# EAGLE design SolenoidDriverCircuit (EAGLE 6.4)
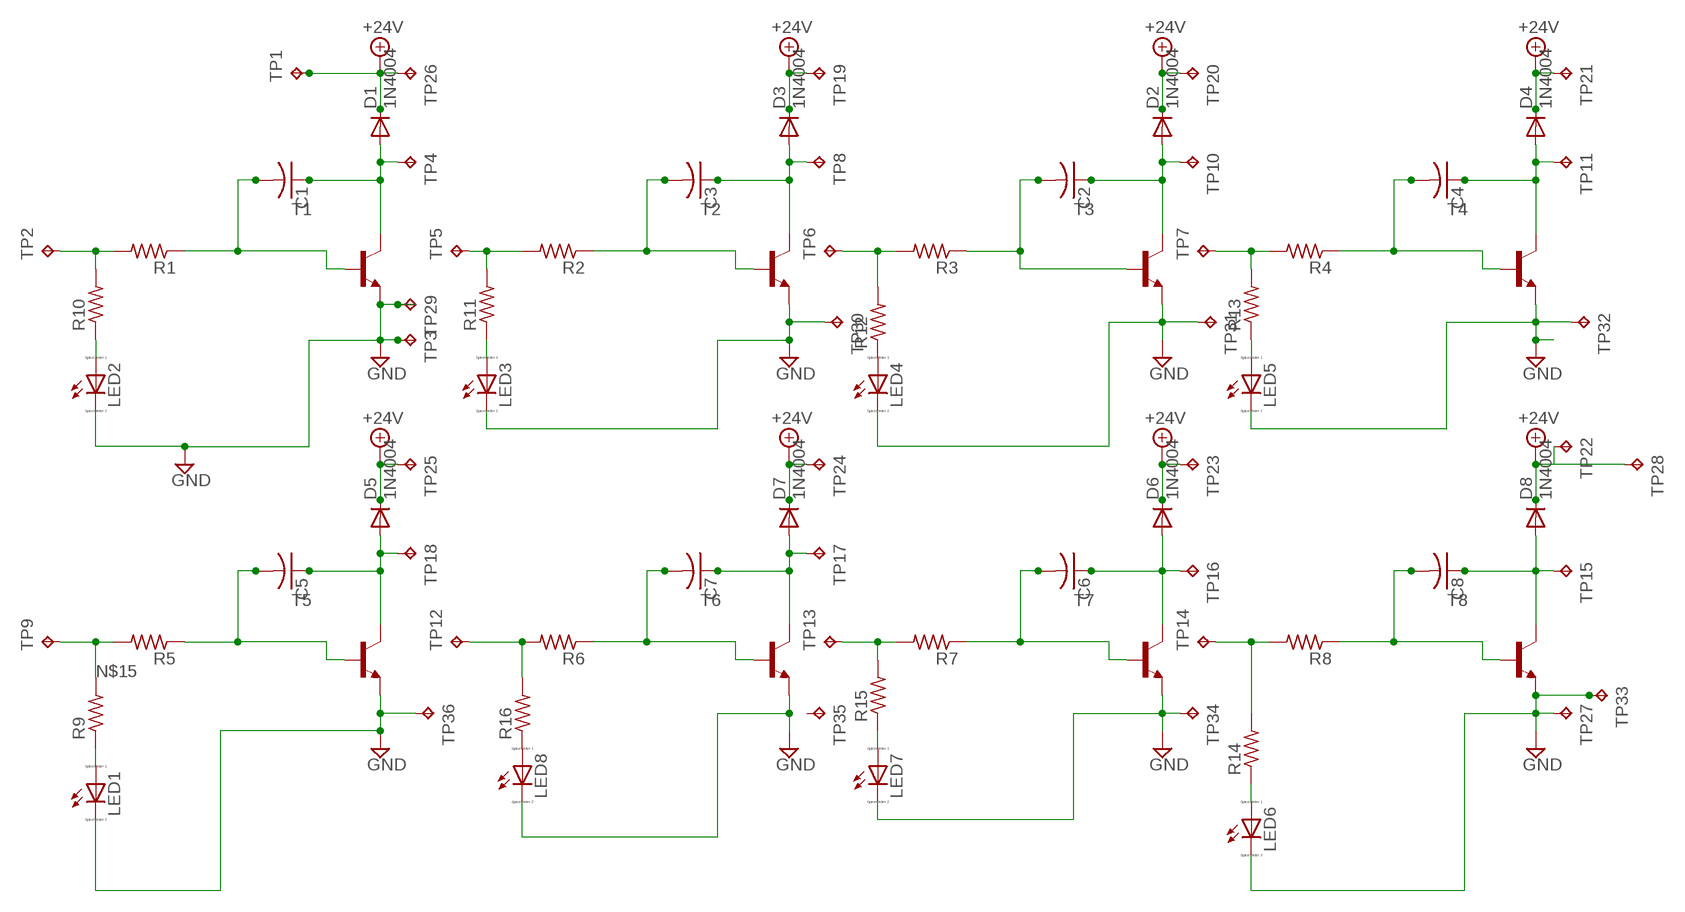
[diagram p0: schematic, sheet 1]

## Parts
C1  C-US050-024X044  [C050-024X044]
C2  C-US050-024X044  [C050-024X044]
C3  C-US050-024X044  [C050-024X044]
C4  C-US050-024X044  [C050-024X044]
C5  C-US050-024X044  [C050-024X044]
C6  C-US050-024X044  [C050-024X044]
C7  C-US050-024X044  [C050-024X044]
C8  C-US050-024X044  [C050-024X044]
D1  1N4004  [DO41-10]
D2  1N4004  [DO41-10]
D3  1N4004  [DO41-10]
D4  1N4004  [DO41-10]
D5  1N4004  [DO41-10]
D6  1N4004  [DO41-10]
D7  1N4004  [DO41-10]
D8  1N4004  [DO41-10]
LED1  LED_ELD260  [LED_LD260]
LED2  LED_ELD260  [LED_LD260]
LED3  LED_ELD260  [LED_LD260]
LED4  LED_ELD260  [LED_LD260]
LED5  LED_ELD260  [LED_LD260]
LED6  LED_ELD260  [LED_LD260]
LED7  LED_ELD260  [LED_LD260]
LED8  LED_ELD260  [LED_LD260]
R1  R-US_0207/2V  [0207/2V]
R2  R-US_0207/2V  [0207/2V]
R3  R-US_0207/2V  [0207/2V]
R4  R-US_0207/2V  [0207/2V]
R5  R-US_0207/2V  [0207/2V]
R6  R-US_0207/2V  [0207/2V]
R7  R-US_0207/2V  [0207/2V]
R8  R-US_0207/2V  [0207/2V]
R9  R-US_0207/2V  [0207/2V]
R10  R-US_0207/2V  [0207/2V]
R11  R-US_0207/2V  [0207/2V]
R12  R-US_0207/2V  [0207/2V]
R13  R-US_0207/2V  [0207/2V]
R14  R-US_0207/2V  [0207/2V]
R15  R-US_0207/2V  [0207/2V]
R16  R-US_0207/2V  [0207/2V]
T1  -NPN-TO220V  [TO220V]
T2  -NPN-TO220V  [TO220V]
T3  -NPN-TO220V  [TO220V]
T4  -NPN-TO220V  [TO220V]
T5  -NPN-TO220V  [TO220V]
T6  -NPN-TO220V  [TO220V]
T7  -NPN-TO220V  [TO220V]
T8  -NPN-TO220V  [TO220V]
TP1  TPPAD1-13Y  [P1-13Y]
TP2  TPPAD1-13  [P1-13]
TP3  TPPAD1-13Y  [P1-13Y]
TP4  TPPAD1-13Y  [P1-13Y]
TP5  TPPAD1-13  [P1-13]
TP6  TPPAD1-13  [P1-13]
TP7  TPPAD1-13  [P1-13]
TP8  TPPAD1-13Y  [P1-13Y]
TP9  TPPAD1-13  [P1-13]
TP10  TPPAD1-13Y  [P1-13Y]
TP11  TPPAD1-13Y  [P1-13Y]
TP12  TPPAD1-13  [P1-13]
TP13  TPPAD1-13  [P1-13]
TP14  TPPAD1-13  [P1-13]
TP15  TPPAD1-13Y  [P1-13Y]
TP16  TPPAD1-13Y  [P1-13Y]
TP17  TPPAD1-13Y  [P1-13Y]
TP18  TPPAD1-13Y  [P1-13Y]
TP19  TPPAD1-13Y  [P1-13Y]
TP20  TPPAD1-13Y  [P1-13Y]
TP21  TPPAD1-13Y  [P1-13Y]
TP22  TPPAD1-13Y  [P1-13Y]
TP23  TPPAD1-13Y  [P1-13Y]
TP24  TPPAD1-13Y  [P1-13Y]
TP25  TPPAD1-13Y  [P1-13Y]
TP26  TPPAD1-13Y  [P1-13Y]
TP27  TPPAD1-13Y  [P1-13Y]
TP28  TPPAD1-13Y  [P1-13Y]
TP29  TPPAD1-13  [P1-13]
TP30  TPPAD1-13  [P1-13]
TP31  TPPAD1-13  [P1-13]
TP32  TPPAD1-13  [P1-13]
TP33  TPPAD1-13  [P1-13]
TP34  TPPAD1-13  [P1-13]
TP35  TPPAD1-13  [P1-13]
TP36  TPPAD1-13  [P1-13]

## Nets
+24V [SUPPLY]: D1.C D2.C D3.C D4.C D5.C D6.C D7.C D8.C TP1.TP TP19.TP TP20.TP TP21.TP TP22.TP TP23.TP TP24.TP TP25.TP TP26.TP TP28.TP
GND [GND]: LED1.K(C) LED2.K(C) LED3.K(C) LED4.K(C) LED5.K(C) LED6.K(C) LED7.K(C) LED8.K(C) T1.3(E) T2.3(E) T3.3(E) T4.3(E) T5.3(E) T6.3(E) T7.3(E) T8.3(E) TP3.TP TP27.TP TP29.TP TP30.TP TP31.TP TP32.TP TP33.TP TP34.TP TP36.TP
N$1: C1.1 D1.A T1.2(C) TP4.TP
N$2: C1.2 R1.1 T1.1(B)
N$3: R1.2 R10.2 TP2.TP
N$4: C2.1 D2.A T3.2(C) TP10.TP
N$6: R3.2 R12.2 TP6.TP
N$7: C3.1 D3.A T2.2(C) TP8.TP
N$8: C3.2 R2.1 T2.1(B)
N$9: R2.2 R11.2 TP5.TP
N$10: C4.1 D4.A T4.2(C) TP11.TP
N$11: C4.2 R4.1 T4.1(B)
N$12: R4.2 R13.2 TP7.TP
N$13: C5.1 D5.A T5.2(C) TP18.TP
N$14: C5.2 R5.1 T5.1(B)
N$15: R5.2 R9.2 TP9.TP
N$16: C6.1 D6.A T7.2(C) TP16.TP
N$17: C6.2 R7.1 T7.1(B)
N$18: R7.2 R15.2 TP13.TP
N$19: C7.1 D7.A T6.2(C) TP17.TP
N$20: C7.2 R6.1 T6.1(B)
N$21: R6.2 R16.2 TP12.TP
N$22: C8.1 D8.A T8.2(C) TP15.TP
N$23: C8.2 R8.1 T8.1(B)
N$24: R8.2 R14.2 TP14.TP
N$25: LED1.A R9.1
N$26: LED2.A R10.1
N$27: C2.2 R3.1 T3.1(B)
N$28: LED3.A R11.1
N$29: LED4.A R12.1
N$32: LED5.A R13.1
N$34: LED6.A R14.1
N$36: LED7.A R15.1
N$38: LED8.A R16.1
Unconnected: TP35.TP

## Library data of the parts
C1-C8 = rcl:C-US: CAPACITOR, American symbol
D1-D8 = diode:1N4004: DIODE general purpose rectifier, 1 A
LED1-LED8 = eagle-ltspice:LED_E: LED Source: http://www.osram.convergy.de Source: www.luxeon.com Source: www.kingbright.com; SPICEMODEL: NONE; SPICEPREFIX: D; SPICETYPE: diode
R1-R16 = rcl:R-US_: RESISTOR, American symbol
T1-T8 = transistor:*-NPN-: NPN Transistror BF959 corrected 2008.03.06
TP1-TP36 = testpad:TP: Test pad

## Net classes
2 GND: width 1.143 mm
3 SUPPLY: width 1.143 mm

## Board
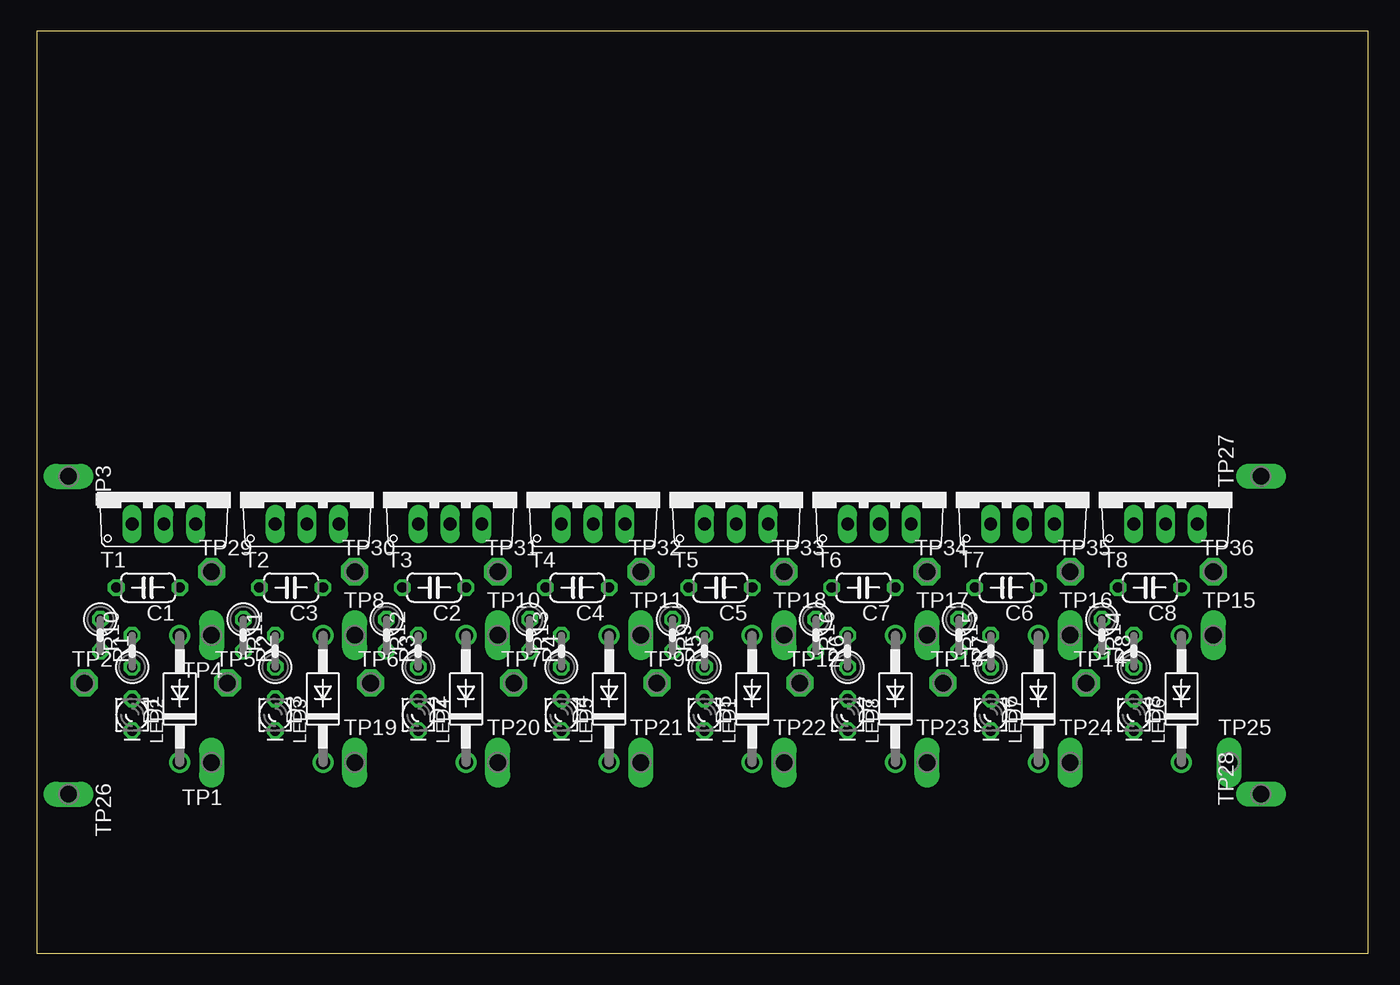
[diagram p1: board, top side]
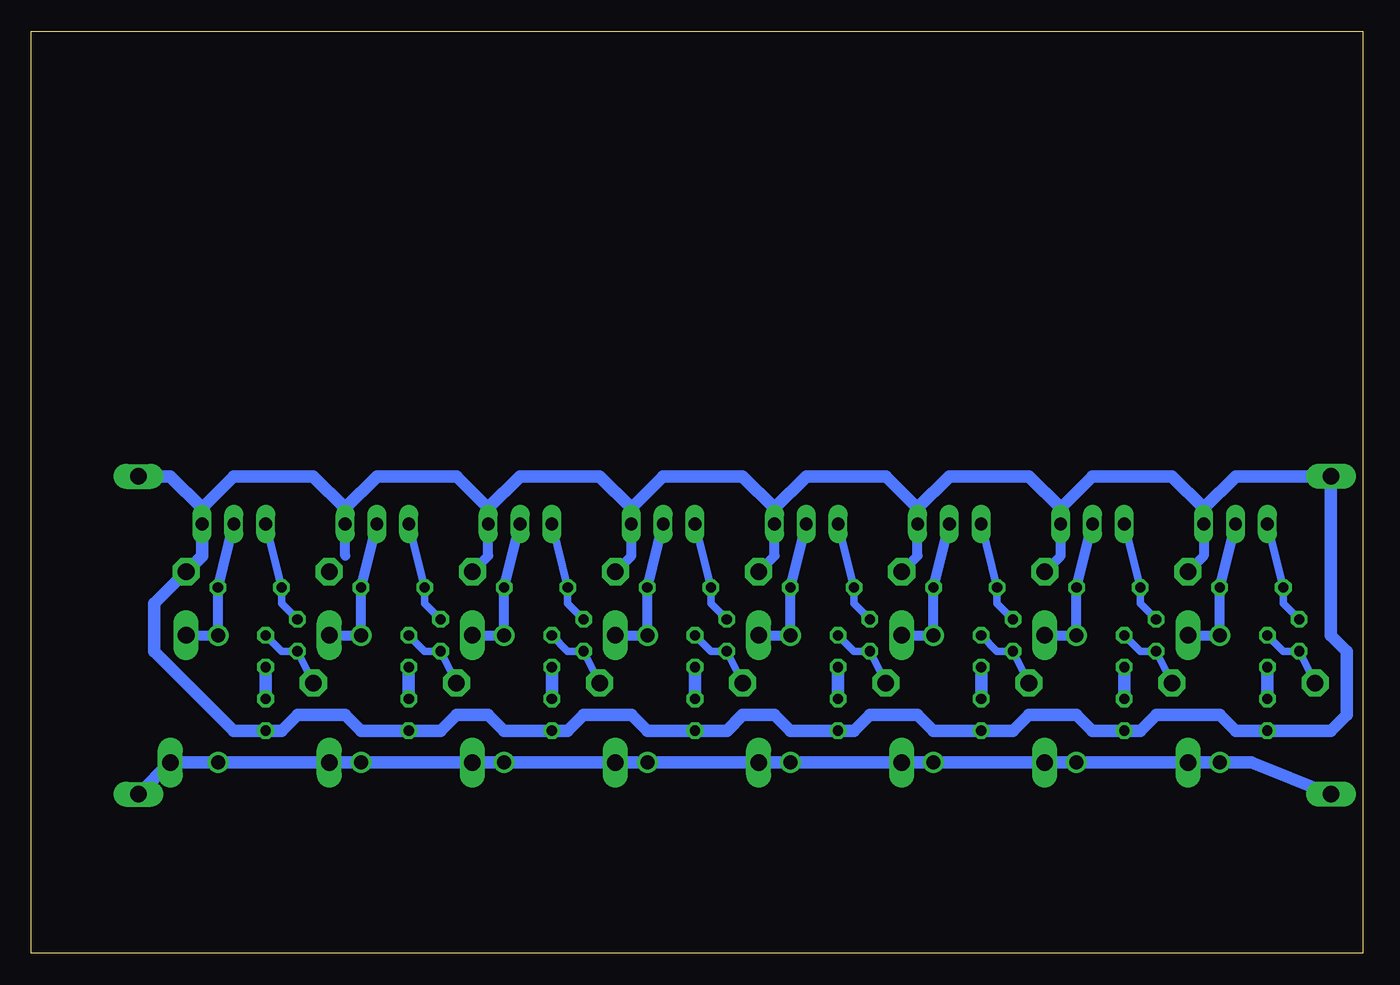
[diagram p2: board, bottom side, seen from below]

Size 106.35 x 73.65 mm. Coordinates in mm from the lower left corner, seen from the top.
Outline: 0,0 106.35,0 106.35,73.65 0,73.65 0,0
Copper layers (1*16): Top 0.035mm / dielectric 1.5mm / Bottom 0.035mm
Design rules "default": minimum track width 10mil, minimum drill 24mil, track to track 8mil, track to pad 8mil, pad to pad 8mil, via to via 8mil, smd to smd 8mil, copper to edge 40mil, drill to drill 8mil, minimum pad ring 10mil, minimum via ring 8mil, stop-mask expansion 4mil, vias tented up to drill 0mil, thermal gap 10mil

### Footprints (pad centres in the part's own frame; a part is rotated, then mirrored left to right if it is on the bottom)
C050-024X044 = drill 0.813 octagon: 1 -2.54,0; 2 2.54,0
DO41-10 = drill 1.118: A 5.08,0; C -5.08,0
LED_LD260 = drill 0.813 octagon: A -1.27,0; K 1.27,0
0207/2V = drill 0.813 octagon: 1 -1.27,0; 2 1.27,0
TO220V = drill 1.016 long: 1 -2.54,-2.54; 2 0,-2.54; 3 2.54,-2.54
P1-13Y = drill 1.321 pad 1.905 long: TP 0,0
P1-13 = drill 1.321 pad 2.159 octagon: TP 0,0

### Placement (x,y rotation side)
C1  8.89,29.21 180 top
C2  31.75,29.21 180 top
C3  20.32,29.21 180 top
C4  43.18,29.21 180 top
C5  54.61,29.21 180 top
C6  77.47,29.21 180 top
C7  66.04,29.21 180 top
C8  88.9,29.21 180 top
D1  11.43,20.32 90 top
D2  34.29,20.32 90 top
D3  22.86,20.32 90 top
D4  45.72,20.32 90 top
D5  57.15,20.32 90 top
D6  80.01,20.32 90 top
D7  68.58,20.32 90 top
D8  91.44,20.32 90 top
LED1  53.34,19.05 270 top
LED2  7.62,19.05 270 top
LED3  19.05,19.05 270 top
LED4  30.48,19.05 270 top
LED5  41.91,19.05 270 top
LED6  87.63,19.05 270 top
LED7  76.2,19.05 270 top
LED8  64.77,19.05 270 top
R1  5.08,25.4 270 top
R2  16.51,25.4 270 top
R3  27.94,25.4 270 top
R4  39.37,25.4 270 top
R5  50.8,25.4 270 top
R6  62.23,25.4 270 top
R7  73.66,25.4 270 top
R8  85.09,25.4 270 top
R9  53.34,24.13 90 top
R10  7.62,24.13 90 top
R11  19.05,24.13 90 top
R12  30.48,24.13 90 top
R13  41.91,24.13 90 top
R14  87.63,24.13 90 top
R15  76.2,24.13 90 top
R16  64.77,24.13 90 top
T1  10.16,36.83 0 top
T2  21.59,36.83 0 top
T3  33.02,36.83 0 top
T4  44.45,36.83 0 top
T5  55.88,36.83 0 top
T6  67.31,36.83 0 top
T7  78.74,36.83 0 top
T8  90.17,36.83 0 top
TP1  13.97,15.24 180 top
TP2  3.81,21.59 0 top
TP3  2.54,38.1 270 top
TP4  13.97,25.4 180 top
TP5  15.24,21.59 0 top
TP6  26.67,21.59 0 top
TP7  38.1,21.59 0 top
TP8  25.4,25.4 0 top
TP9  49.53,21.59 0 top
TP10  36.83,25.4 0 top
TP11  48.26,25.4 0 top
TP12  60.96,21.59 0 top
TP13  72.39,21.59 0 top
TP14  83.82,21.59 0 top
TP15  93.98,25.4 0 top
TP16  82.55,25.4 0 top
TP17  71.12,25.4 0 top
TP18  59.69,25.4 0 top
TP19  25.4,15.24 0 top
TP20  36.83,15.24 0 top
TP21  48.26,15.24 0 top
TP22  59.69,15.24 0 top
TP23  71.12,15.24 0 top
TP24  82.55,15.24 0 top
TP25  95.25,15.24 0 top
TP26  2.54,12.7 270 top
TP27  97.79,38.1 90 top
TP28  97.79,12.7 90 top
TP29  13.97,30.48 0 top
TP30  25.4,30.48 0 top
TP31  36.83,30.48 0 top
TP32  48.26,30.48 0 top
TP33  59.69,30.48 0 top
TP34  71.12,30.48 0 top
TP35  82.55,30.48 0 top
TP36  93.98,30.48 0 top

### Tracks (layer width: path | path; a pad name or v marks a point on that pad's centre or on a via)
+24V
  Bottom 1.016: TP28.TP TP25.TP D8.C TP24.TP D6.C TP23.TP D7.C TP22.TP D5.C TP21.TP D4.C TP20.TP D2.C TP19.TP D3.C TP1.TP D1.C 8.89,15.24 TP26.TP
GND
  Bottom 0.406: T2.3 24.13,35.56 | T3.3 35.56,35.56 | T4.3 46.99,35.56 | T5.3 58.42,35.56 | T6.3 69.85,35.56 | T7.3 81.28,35.56 | 92.71,35.56 T8.3
  Bottom 0.813: 81.28,31.75 T7.3 | TP34.TP 69.85,31.75 T6.3 | TP33.TP 58.42,31.75 T5.3 | TP32.TP 46.99,31.75 T4.3 | TP31.TP 35.56,31.75 T3.3 | TP30.TP 24.13,31.75 T2.3 | T1.3 12.7,31.75 TP29.TP
  Bottom 1.016: 12.7,35.56 15.24,38.1 21.59,38.1 24.13,35.56 26.67,38.1 33.02,38.1 35.56,35.56 38.1,38.1 44.45,38.1 46.99,35.56 49.53,38.1 55.88,38.1 58.42,35.56 60.96,38.1 67.31,38.1 69.85,35.56 72.39,38.1 78.74,38.1 81.28,35.56 83.82,38.1 90.17,38.1 92.71,35.56 95.25,38.1 TP27.TP | T8.3 92.71,31.75 TP36.TP 96.52,27.94 96.52,24.13 90.17,17.78 LED6.K 86.36,17.78 85.09,19.05 81.28,19.05 80.01,17.78 LED7.K 73.66,17.78 72.39,19.05 69.85,19.05 68.58,17.78 LED8.K 63.5,17.78 62.23,19.05 58.42,19.05 57.15,17.78 LED1.K 50.8,17.78 49.53,19.05 46.99,19.05 45.72,17.78 LED5.K 40.64,17.78 39.37,19.05 35.56,19.05 34.29,17.78 LED4.K 27.94,17.78 26.67,19.05 22.86,19.05 21.59,17.78 LED3.K 17.78,17.78 16.51,19.05 11.43,19.05 10.16,17.78 LED2.K 2.54,17.78 1.27,19.05 1.27,24.13 2.54,25.4 TP3.TP 10.16,38.1 12.7,35.56 | T1.3 12.7,35.56
N$1
  Bottom 0.813: T1.2 C1.1 D1.A TP4.TP
N$2
  Bottom 0.61: T1.1 C1.2 6.35,27.94 R1.1
N$3
  Bottom 0.61: TP2.TP R1.2 6.35,24.13 R10.2
N$4
  Bottom 0.813: T3.2 C2.1 D2.A TP10.TP
N$6
  Bottom 0.61: TP6.TP R3.2 29.21,24.13 R12.2
N$7
  Bottom 0.813: T2.2 C3.1 D3.A TP8.TP
N$8
  Bottom 0.61: T2.1 C3.2 17.78,27.94 R2.1
N$9
  Bottom 0.61: TP5.TP R2.2 17.78,24.13 R11.2
N$10
  Bottom 0.813: T4.2 C4.1 D4.A TP11.TP
N$11
  Bottom 0.61: T4.1 C4.2 40.64,27.94 R4.1
N$12
  Bottom 0.61: TP7.TP R4.2 40.64,24.13 R13.2
N$13
  Bottom 0.813: T5.2 C5.1 D5.A TP18.TP
N$14
  Bottom 0.61: T5.1 C5.2 52.07,27.94 R5.1
N$15
  Bottom 0.61: TP9.TP R5.2 52.07,24.13 R9.2
N$16
  Bottom 0.813: T7.2 C6.1 D6.A TP16.TP
N$17
  Bottom 0.61: T7.1 C6.2 74.93,27.94 R7.1
N$18
  Bottom 0.61: TP13.TP R7.2 74.93,24.13 R15.2
N$19
  Bottom 0.813: T6.2 C7.1 D7.A TP17.TP
N$20
  Bottom 0.61: T6.1 C7.2 63.5,27.94 R6.1
N$21
  Bottom 0.61: TP12.TP R6.2 63.5,24.13 R16.2
N$22
  Bottom 0.813: T8.2 C8.1 D8.A TP15.TP
N$23
  Bottom 0.61: T8.1 C8.2 86.36,27.94 R8.1
N$24
  Bottom 0.61: TP14.TP R8.2 86.36,24.13 R14.2
N$25
  Bottom 1.016: R9.1 LED1.A
N$26
  Bottom 1.016: R10.1 LED2.A
N$27
  Bottom 0.61: T3.1 C2.2 29.21,27.94 R3.1
N$28
  Bottom 1.016: R11.1 LED3.A
N$29
  Bottom 1.016: R12.1 LED4.A
N$32
  Bottom 1.016: R13.1 LED5.A
N$34
  Bottom 1.016: R14.1 LED6.A
N$36
  Bottom 1.016: R15.1 LED7.A
N$38
  Bottom 1.016: R16.1 LED8.A